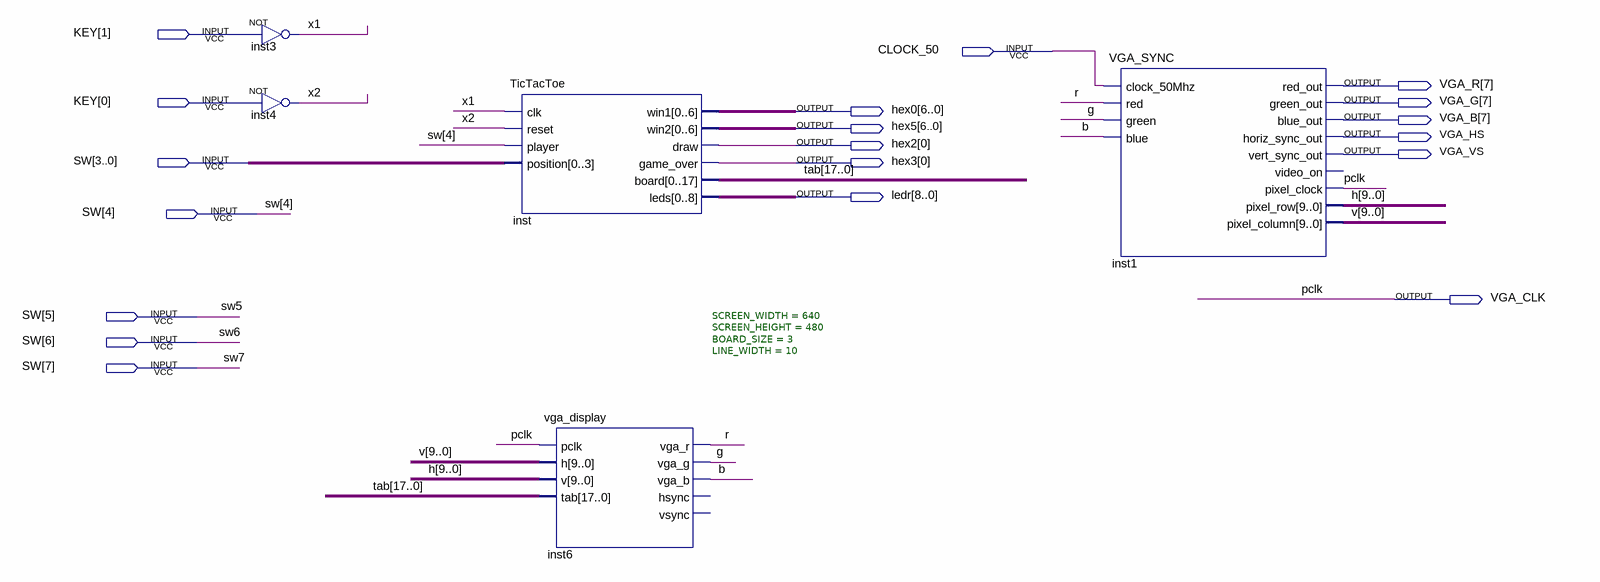
[diagram p0: schematic sheet]
// Quartus schematic pratica4.bdf as structural Verilog: 5 symbols, 19 pins
module pratica4 (
  input  [1:0] KEY,
  input  CLOCK_50,
  input  [7:0] SW,
  output [7:7] VGA_R,
  output [7:7] VGA_G,
  output [6:0] hex0,
  output [7:7] VGA_B,
  output [6:0] hex5,
  output VGA_HS,
  output [0:0] hex2,
  output VGA_VS,
  output [0:0] hex3,
  output [8:0] ledr,
  output VGA_CLK
);

  wire b, g, r, x1, x2;
  wire [9:0] h, v;
  wire [17:0] tab;

  not inst3 (x1, KEY[1]);
  not inst4 (x2, KEY[0]);
  TicTacToe inst (
    .clk(x1), .reset(x2), .player(SW[4]), .position(SW[3:0]), .win1(hex0), .win2(hex5), .draw(hex2[0]),
    .game_over(hex3[0]), .board(tab), .leds(ledr));
  vga_display #(.SCREEN_WIDTH(640), .SCREEN_HEIGHT(480), .BOARD_SIZE(3), .LINE_WIDTH(10)) inst6 (
    .pclk(VGA_CLK), .h(v), .v(h), .tab(tab), .vga_r(r), .vga_g(g), .vga_b(b));  // open: hsync, vsync
  VGA_SYNC inst1 (
    .clock_50Mhz(CLOCK_50), .red(r), .green(g), .blue(b), .red_out(VGA_R[7]), .green_out(VGA_G[7]),
    .blue_out(VGA_B[7]), .horiz_sync_out(VGA_HS), .vert_sync_out(VGA_VS), .pixel_clock(VGA_CLK),
    .pixel_row(h), .pixel_column(v));  // open: video_on

  // Other names for the same wires on the sheet: pclk = VGA_CLK
endmodule
